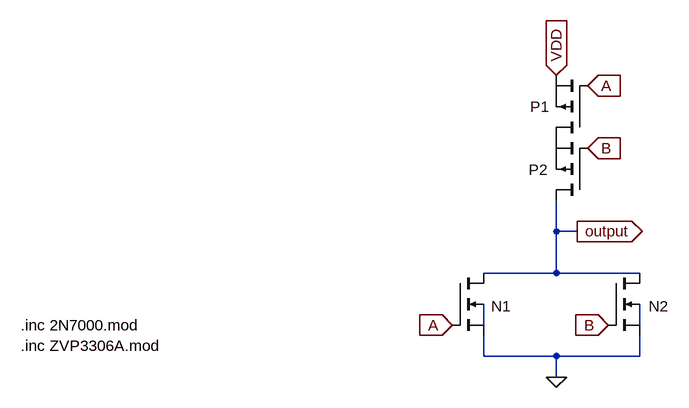
[diagram p0: schematic NOR.asc]
NOR.asc, the LTspice schematic file:
Version 4.1
SHEET 1 1280 680
WIRE 816 144 816 96
WIRE 848 144 816 144
WIRE 816 208 816 144
WIRE 816 208 704 208
WIRE 944 208 816 208
WIRE 704 288 704 256
WIRE 944 288 944 256
WIRE 704 336 704 304
WIRE 816 336 704 336
WIRE 944 336 944 304
WIRE 944 336 816 336
WIRE 816 368 816 336
FLAG 816 368 0
FLAG 816 -96 VDD
IOPIN 816 -96 In
FLAG 848 144 output
IOPIN 848 144 Out
FLAG 864 -80 A
IOPIN 864 -80 In
FLAG 656 288 A
IOPIN 656 288 In
FLAG 864 16 B
IOPIN 864 16 In
FLAG 896 288 B
IOPIN 896 288 In
SYMBOL nmos4 656 208 R0
WINDOW 0 60 51 Left 2
WINDOW 3 56 72 Invisible 2
SYMATTR InstName N1
SYMATTR Value 2N7000
SYMATTR Prefix X
SYMBOL pmos 864 0 R180
WINDOW 0 59 48 Left 2
WINDOW 3 56 72 Invisible 2
SYMATTR InstName P1
SYMATTR Value ZVP3306A
SYMATTR Prefix X
SYMBOL nmos4 896 208 R0
WINDOW 0 62 51 Left 2
WINDOW 3 56 72 Invisible 2
SYMATTR InstName N2
SYMATTR Value 2N7000
SYMATTR Prefix X
SYMBOL pmos 864 96 R180
WINDOW 0 61 47 Left 2
WINDOW 3 56 72 Invisible 2
SYMATTR InstName P2
SYMATTR Value ZVP3306A
SYMATTR Prefix X
TEXT -8 288 Left 2 !.inc 2N7000.mod
TEXT -8 320 Left 2 !.inc ZVP3306A.mod

The netlist it stands for:
* NOR.asc
X§N1 output A 0 N001 2N7000  ; pins D G S B
X§P1 P001 A VDD ZVP3306A  ; pins D G S
X§N2 output B 0 N002 2N7000  ; pins D G S B
X§P2 output B P001 ZVP3306A  ; pins D G S
.inc 2N7000.mod
.inc ZVP3306A.mod
.backanno
.end